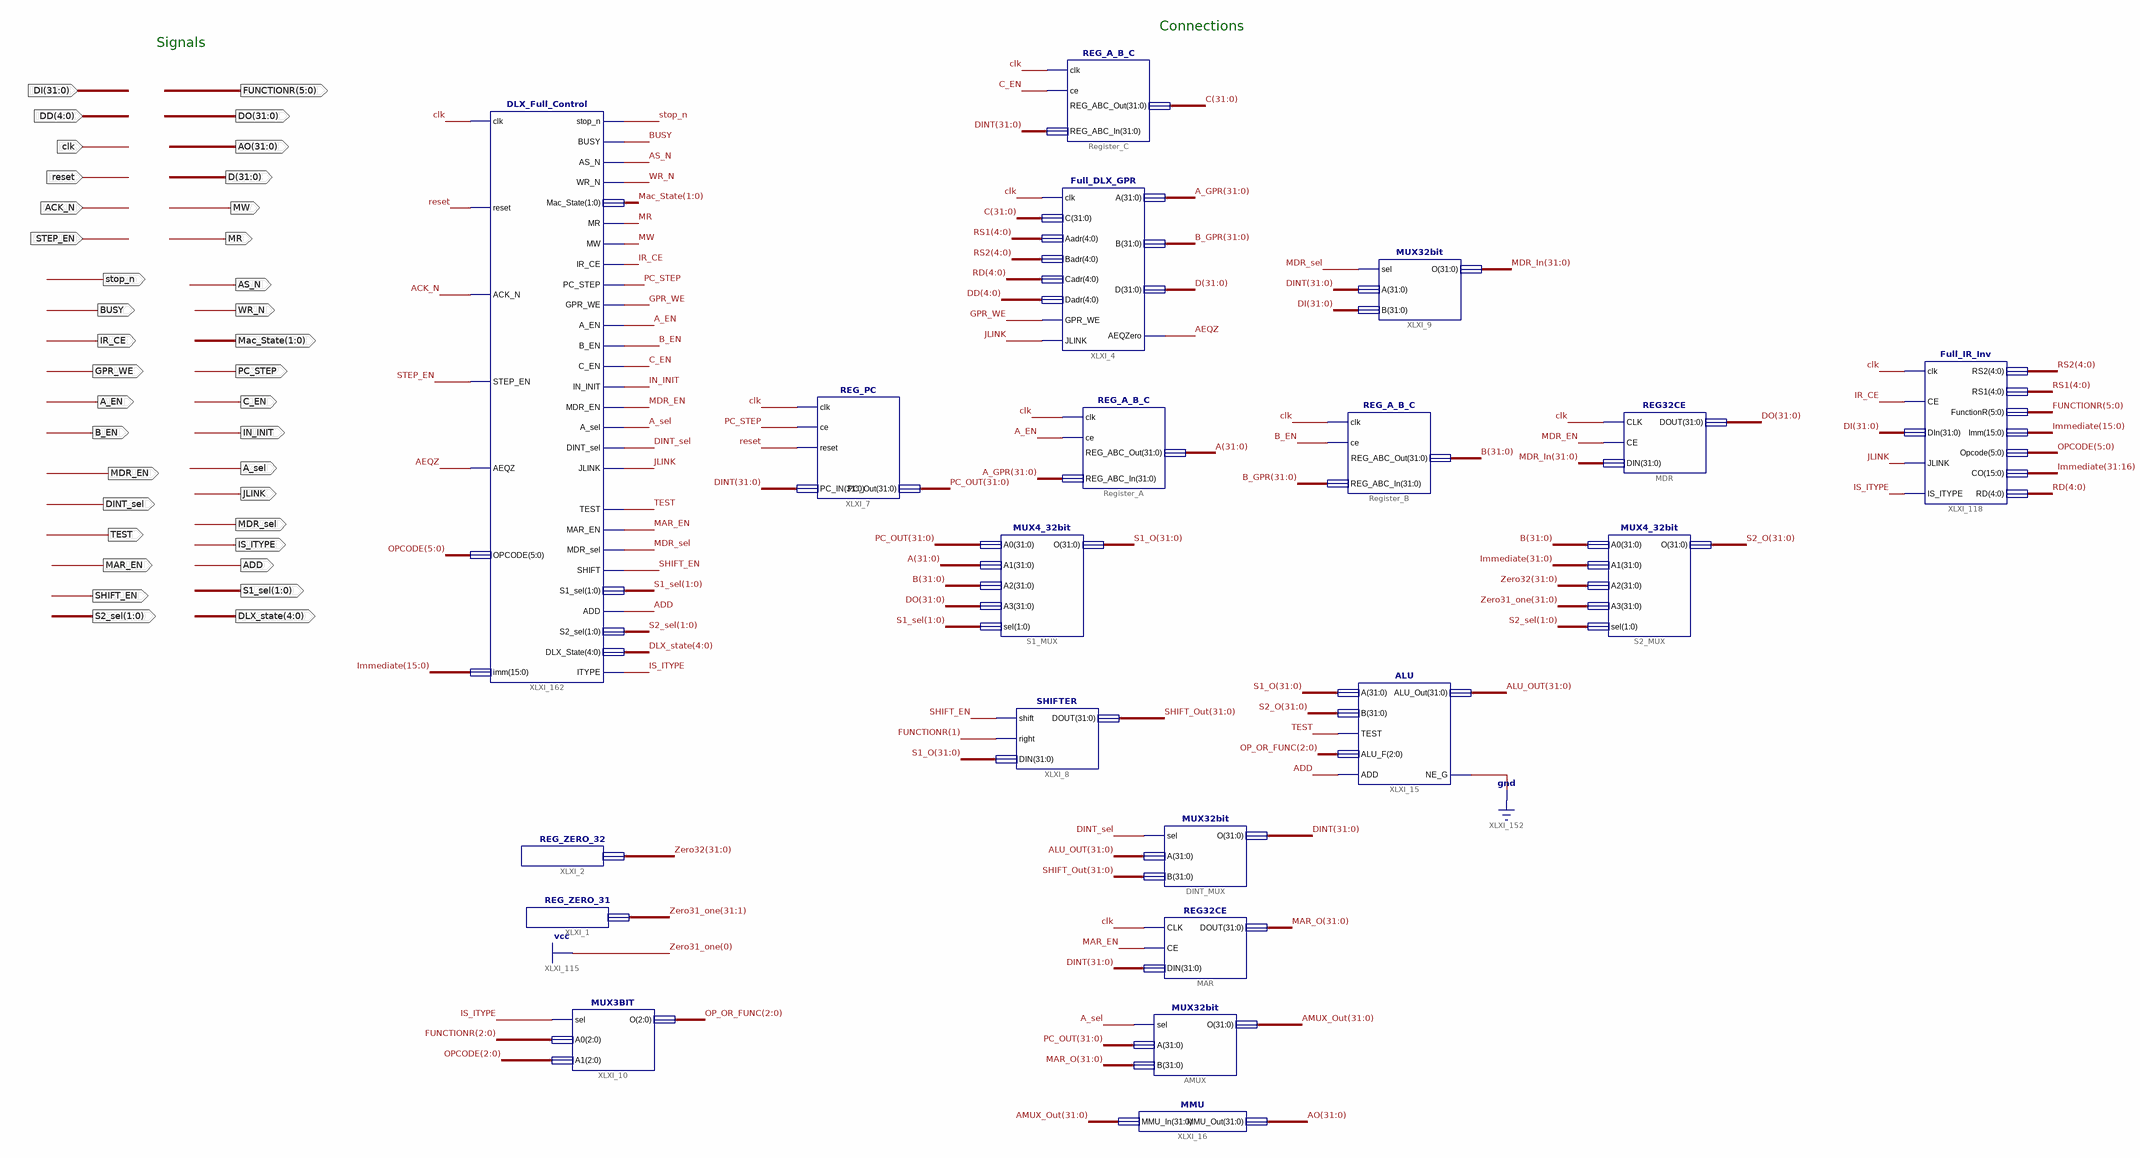
[diagram p0: schematic sheet 1]
// Xilinx ISE schematic Full_Data_Path.sch (spartan6) as structural Verilog: 20 symbols, 37 ports
module Full_Data_Path (
  input  clk,
  input  reset,
  input  ACK_N,
  input  STEP_EN,
  input  [31:0] DI,
  input  [4:0] DD,
  output [5:0] FUNCTIONR,
  output [31:0] D,
  output MW,
  output MR,
  output BUSY,
  output IR_CE,
  output GPR_WE,
  output A_EN,
  output B_EN,
  output AS_N,
  output WR_N,
  output [1:0] Mac_State,
  output PC_STEP,
  output C_EN,
  output IN_INIT,
  output A_sel,
  output JLINK,
  output MDR_EN,
  output DINT_sel,
  output TEST,
  output MAR_EN,
  output MDR_sel,
  output IS_ITYPE,
  output ADD,
  output [1:0] S2_sel,
  output [1:0] S1_sel,
  output [4:0] DLX_state,
  output stop_n,
  output [31:0] DO,
  output [31:0] AO,
  output SHIFT_EN
);

  wire AEQZ;
  wire [2:0] OP_OR_FUNC;
  wire [4:0] RD, RS1, RS2;
  wire [5:0] OPCODE;
  wire [31:0] A, A_GPR, ALU_OUT, AMUX_Out, B, B_GPR, C, DINT, Immediate, MAR_O, MDR_In, PC_OUT, S1_O, S2_O,
       SHIFT_Out, Zero32;
  wire [31:1] Zero31_one;

  Full_DLX_GPR XLXI_4 (
    .clk(clk), .C(C), .Aadr(RS1), .Badr(RS2), .Cadr(RD), .Dadr(DD), .GPR_WE(GPR_WE), .JLINK(JLINK),
    .A(A_GPR), .B(B_GPR), .D(D), .AEQZero(AEQZ));
  MUX4_32bit S1_MUX (.A0(PC_OUT), .A1(A), .A2(B), .A3(DO), .sel(S1_sel), .O(S1_O));
  REG32CE MDR (.CLK(clk), .CE(MDR_EN), .DIN(MDR_In), .DOUT(DO));
  Full_IR_Inv XLXI_118 (
    .clk(clk), .CE(IR_CE), .DIn(DI), .JLINK(JLINK), .IS_ITYPE(IS_ITYPE), .RS2(RS2), .RS1(RS1),
    .FunctionR(FUNCTIONR), .Imm(Immediate[15:0]), .Opcode(OPCODE), .CO(Immediate[31:16]), .RD(RD));
  MUX4_32bit S2_MUX (.A0(B), .A1(Immediate), .A2(Zero32), .A3({Zero31_one, 1'b1}), .sel(S2_sel), .O(S2_O));
  ALU XLXI_15 (.A(S1_O), .B(S2_O), .TEST(TEST), .ALU_F(OP_OR_FUNC), .ADD(ADD), .ALU_Out(ALU_OUT), .NE_G(1'b0));
  SHIFTER XLXI_8 (.shift(SHIFT_EN), .right(FUNCTIONR[1]), .DIN(S1_O), .DOUT(SHIFT_Out));
  MUX32bit XLXI_9 (.sel(MDR_sel), .A(DINT), .B(DI), .O(MDR_In));
  REG_ZERO_31 XLXI_1 (.REG_Out(Zero31_one));
  REG_ZERO_32 XLXI_2 (.REG_ZERO_Out(Zero32));
  MUX3BIT XLXI_10 (.sel(IS_ITYPE), .A0(FUNCTIONR[2:0]), .A1(OPCODE[2:0]), .O(OP_OR_FUNC));
  MUX32bit DINT_MUX (.sel(DINT_sel), .A(ALU_OUT), .B(SHIFT_Out), .O(DINT));
  REG32CE MAR (.CLK(clk), .CE(MAR_EN), .DIN(DINT), .DOUT(MAR_O));
  MMU XLXI_16 (.MMU_In(AMUX_Out), .MMU_Out(AO));
  MUX32bit AMUX (.sel(A_sel), .A(PC_OUT), .B(MAR_O), .O(AMUX_Out));
  REG_PC XLXI_7 (.clk(clk), .ce(PC_STEP), .reset(reset), .PC_IN(DINT), .PC_Out(PC_OUT));
  REG_A_B_C Register_C (.clk(clk), .ce(C_EN), .REG_ABC_In(DINT), .REG_ABC_Out(C));
  REG_A_B_C Register_B (.clk(clk), .ce(B_EN), .REG_ABC_In(B_GPR), .REG_ABC_Out(B));
  REG_A_B_C Register_A (.clk(clk), .ce(A_EN), .REG_ABC_In(A_GPR), .REG_ABC_Out(A));
  DLX_Full_Control XLXI_162 (
    .clk(clk), .reset(reset), .ACK_N(ACK_N), .STEP_EN(STEP_EN), .AEQZ(AEQZ), .OPCODE(OPCODE),
    .imm(Immediate[15:0]), .BUSY(BUSY), .AS_N(AS_N), .WR_N(WR_N), .Mac_State(Mac_State), .MR(MR), .MW(MW),
    .IR_CE(IR_CE), .PC_STEP(PC_STEP), .GPR_WE(GPR_WE), .A_EN(A_EN), .B_EN(B_EN), .C_EN(C_EN),
    .IN_INIT(IN_INIT), .MDR_EN(MDR_EN), .A_sel(A_sel), .DINT_sel(DINT_sel), .JLINK(JLINK), .TEST(TEST),
    .MAR_EN(MAR_EN), .MDR_sel(MDR_sel), .SHIFT(SHIFT_EN), .S1_sel(S1_sel), .ADD(ADD), .S2_sel(S2_sel),
    .DLX_State(DLX_state), .ITYPE(IS_ITYPE), .stop_n(stop_n));

  // Notes on the sheet:
  //   Connections
  //   Signals
endmodule
